# EAGLE design CoffeeMakersch (EAGLE 7.2.0)
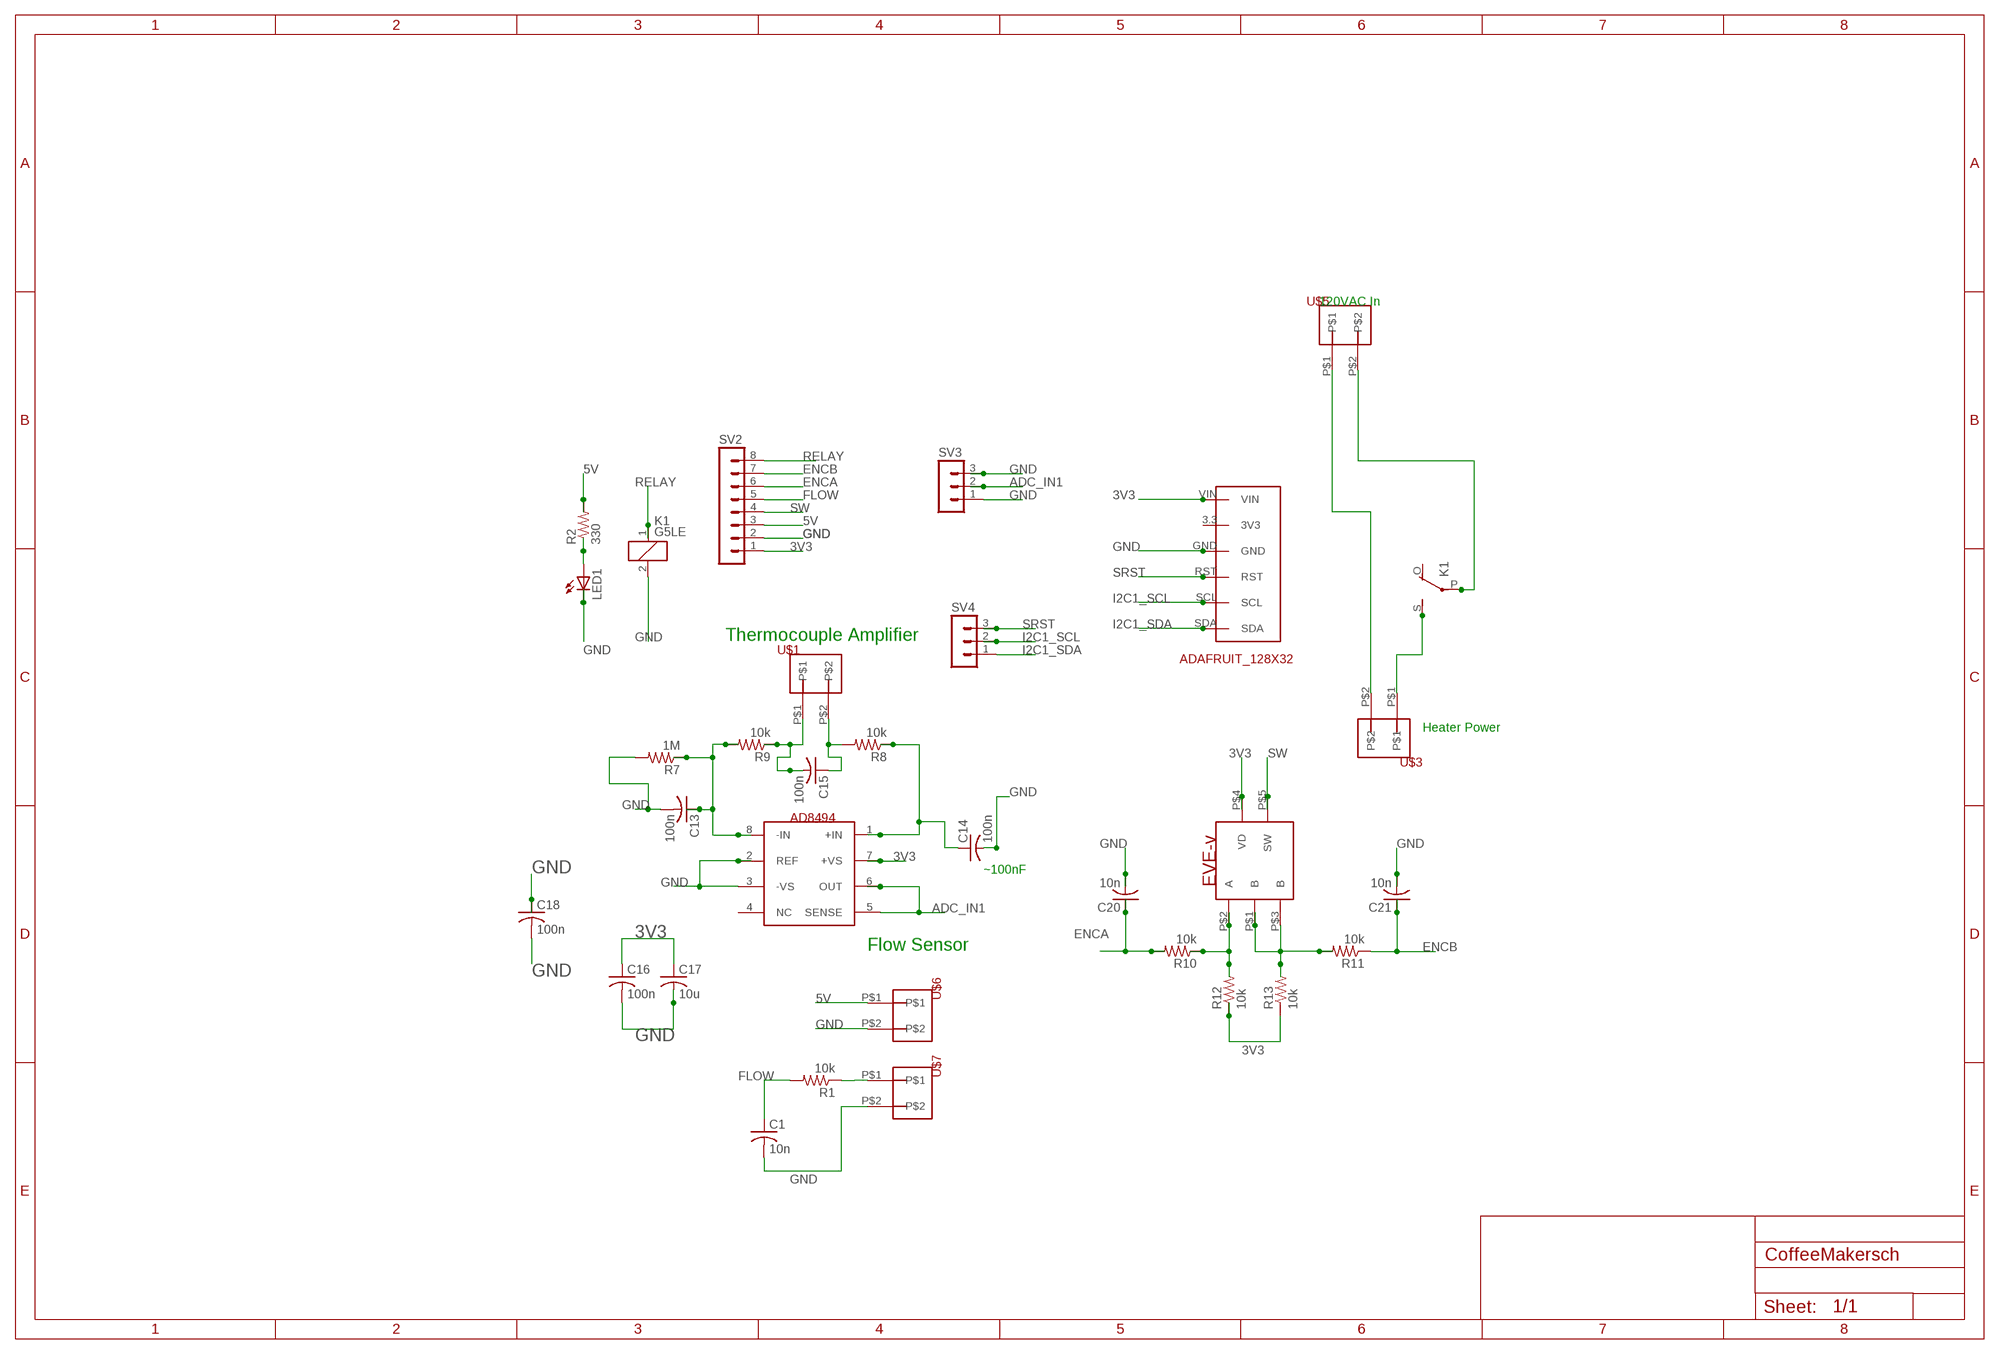
[diagram p0: schematic, sheet 1]

## Parts
C1  10n  C-USC0805  [C0805]
C13  100n  C-USC0805  [C0805]
C14  100n  C-USC0805  [C0805]
C15  100n  C-USC0805  [C0805]
C16  100n  C-USC0805  [C0805]
C17  10u  C-USC0805  [C0805]
C18  100n  C-USC0805  [C0805]
C20  10n  C-USC0805  [C0805]
C21  10n  C-USC0805  [C0805]
K1  G5LE  [G5LE]
LED1  LEDCHIPLED_1206  [CHIPLED_1206]
R1  10k  R-US_R0805  [R0805]
R2  330  R-US_R0805  [R0805]
R7  1M  R-US_R0805  [R0805]
R8  10k  R-US_R0805  [R0805]
R9  10k  R-US_R0805  [R0805]
R10  10k  R-US_R0805  [R0805]
R11  10k  R-US_R0805  [R0805]
R12  10k  R-US_R0805  [R0805]
R13  10k  R-US_R0805  [R0805]
SV2  MA08-1  [MA08-1]
SV3  MA03-1  [MA03-1]
SV4  MA03-1  [MA03-1]
U$1  5TERM  [5TERM]
U$2  AD8494  [TSSOP8]
U$3  5TERM  [5TERM]
U$4  EVE-V  [EVE-V]
U$5  5TERM  [5TERM]
U$6  5TERM  [5TERM]
U$7  5TERM  [5TERM]
U$11  ADAFRUIT_128X32  [ADAFRUIT128X32]

## Nets
3V3: C16.1 C17.1 R12.1 R13.1 SV2.1 U$2.7(+VS) U$4.P$4(VD) U$11.VIN
5V: R2.2 SV2.3 U$6.P$1
ADC_IN1: SV3.2 U$2.5(SENSE) U$2.6(OUT)
ENCA: C20.1 R10.2 SV2.6
ENCB: C21.1 R11.1 SV2.7
FLOW: C1.1 R1.2 SV2.5
GND: C1.2 C13.2 C14.2 C16.2 C17.2 C18.1 C18.2 C20.2 C21.2 K1.2 LED1.C R7.2 SV2.2 SV3.1 SV3.3 U$2.2(REF) U$2.3(-VS) U$6.P$2 U$7.P$2 U$11.GND
I2C1_SCL: SV4.2 U$11.SCL
I2C1_SDA: SV4.1 U$11.SDA
N$1: R1.1 U$7.P$1
N$2: K1.P(2:P) U$5.P$2
N$3: U$3.P$2 U$5.P$1
N$4: K1.S(2:S) U$3.P$1
N$5: LED1.A R2.1
N$6: C13.1 R7.1 R9.2 U$2.8(-IN)
N$7: C14.1 R8.1 U$2.1(+IN)
N$8: C15.1 R8.2 U$1.P$2
N$9: C15.2 R9.1 U$1.P$1
N$13: R10.1 R12.2 U$4.P$2(A)
N$14: R11.2 R13.2 U$4.P$1(B) U$4.P$3(B)
RELAY: K1.1 SV2.8
SRST: SV4.3 U$11.RST
SW: SV2.4 U$4.P$5(SW)
Unconnected: K1.O(2:O) U$2.4(NC) U$11.3.3(3V3)

## Notes on the sheet
- 120VAC In
- Thermocouple Amplifier
- Heater Power
- ~100nF
- Flow Sensor

## Library data of the parts
C1 C13-C18 C20 C21 = rcl:C-US: CAPACITOR, American symbol
K1 = relay:G5LE: RELAY 1 x switch, 10 A/120 V AC, 8 A/30 V DC, Omron; OC_FARNELL: unknown; OC_NEWARK: unknown
LED1 = led:LED: LED OSRAM: - CHIPLED LG R971, LG N971, LY N971, LG Q971, LY Q971, LO R971, LY R971 LH N974, LH R974 LS Q976, LO Q976, LY Q976 LO Q996 - Hyper CHIPLED LW Q18S LB Q993, LB Q99A, LB R99A - SideLED LS A670, LO A670, LY A670, LG A670, LP A670 LB A673, LV A673, LT A673, LW A673 LH A674 LY A675 LS A676, LA A676, LO A676, LY A676, LW A676 LS A679, LY A679, LG A679 - Hyper Micro SIDELED® LS Y876, LA Y876, LO Y876, LY Y876 LT Y87S - SmartLED LW L88C, LW L88S LB L89C, LB L89S, LG L890 LS L89K, LO L89K, LY L89K LS L896, LA L896, LO L896, LY L896 - TOPLED LS T670, LO T670, LY T670, LG T670, LP T670 LSG T670, LSP T670, LSY T670, LOP T670, LYG T670 LG T671, LOG T671, LSG T671 LB T673, LV T673, LT T673, LW T673 LH T674 LS T676, LA T676, LO T676, LY T676, LB T676, LH T676, LSB T676, LW T676 LB T67C, LV T67C, LT T67C, LS T67K, LO T67K, LY T67K, LW E67C LS E67B, LA E67B, LO E67B, LY E67B, LB E67C, LV E67C, LT E67C LW T67C LS T679, LY T679, LG T679 LS T770, LO T770, LY T770, LG T770, LP T770 LB T773, LV T773, LT T773, LW T773 LH T774 LS E675, LA E675, LY E675, LS T675 LS T776, LA T776, LO T776, LY T776, LB T776 LHGB T686 LT T68C, LB T68C - Hyper Mini TOPLED® LB M676 - Mini TOPLED Santana® LG M470 LS M47K, LO M47K, LY M47K Source: http://www.osram.convergy.de LUXEON: - LUMILED® LXK2-PW12-R00, LXK2-PW12-S00, LXK2-PW14-U00, LXK2-PW14-V00 LXK2-PM12-R00, LXK2-PM12-S00, LXK2-PM14-U00 LXK2-PE12-Q00, LXK2-PE12-R00, LXK2-PE12-S00, LXK2-PE14-T00, LXK2-PE14-U00 LXK2-PB12-K00, LXK2-PB12-L00, LXK2-PB12-M00, LXK2-PB14-N00, LXK2-PB14-P00, LXK2-PB14-Q00 LXK2-PR12-L00, LXK2-PR12-M00, LXK2-PR14-Q00, LXK2-PR14-R00 LXK2-PD12-Q00, LXK2-PD12-R00, LXK2-PD12-S00 LXK2-PH12-R00, LXK2-PH12-S00 LXK2-PL12-P00, LXK2-PL12-Q00, LXK2-PL12-R00 Source: www.luxeon.com KINGBRIGHT: KA-3528ASYC Source: www.kingbright.com
R1 R2 R7-R13 = rcl:R-US_: RESISTOR, American symbol
SV2 = con-lstb:MA08-1: PIN HEADER; OC_FARNELL: unknown; OC_NEWARK: unknown
SV3 SV4 = con-lstb:MA03-1: PIN HEADER; OC_FARNELL: unknown; OC_NEWARK: unknown
U$1 U$3 U$5-U$7 = EmbSystems:5TERM
U$2 = EmbSystems:AD8494
U$4 = EmbSystems:EVE-V
U$11 = EmbSystems:ADAFRUIT_128X32

## Board
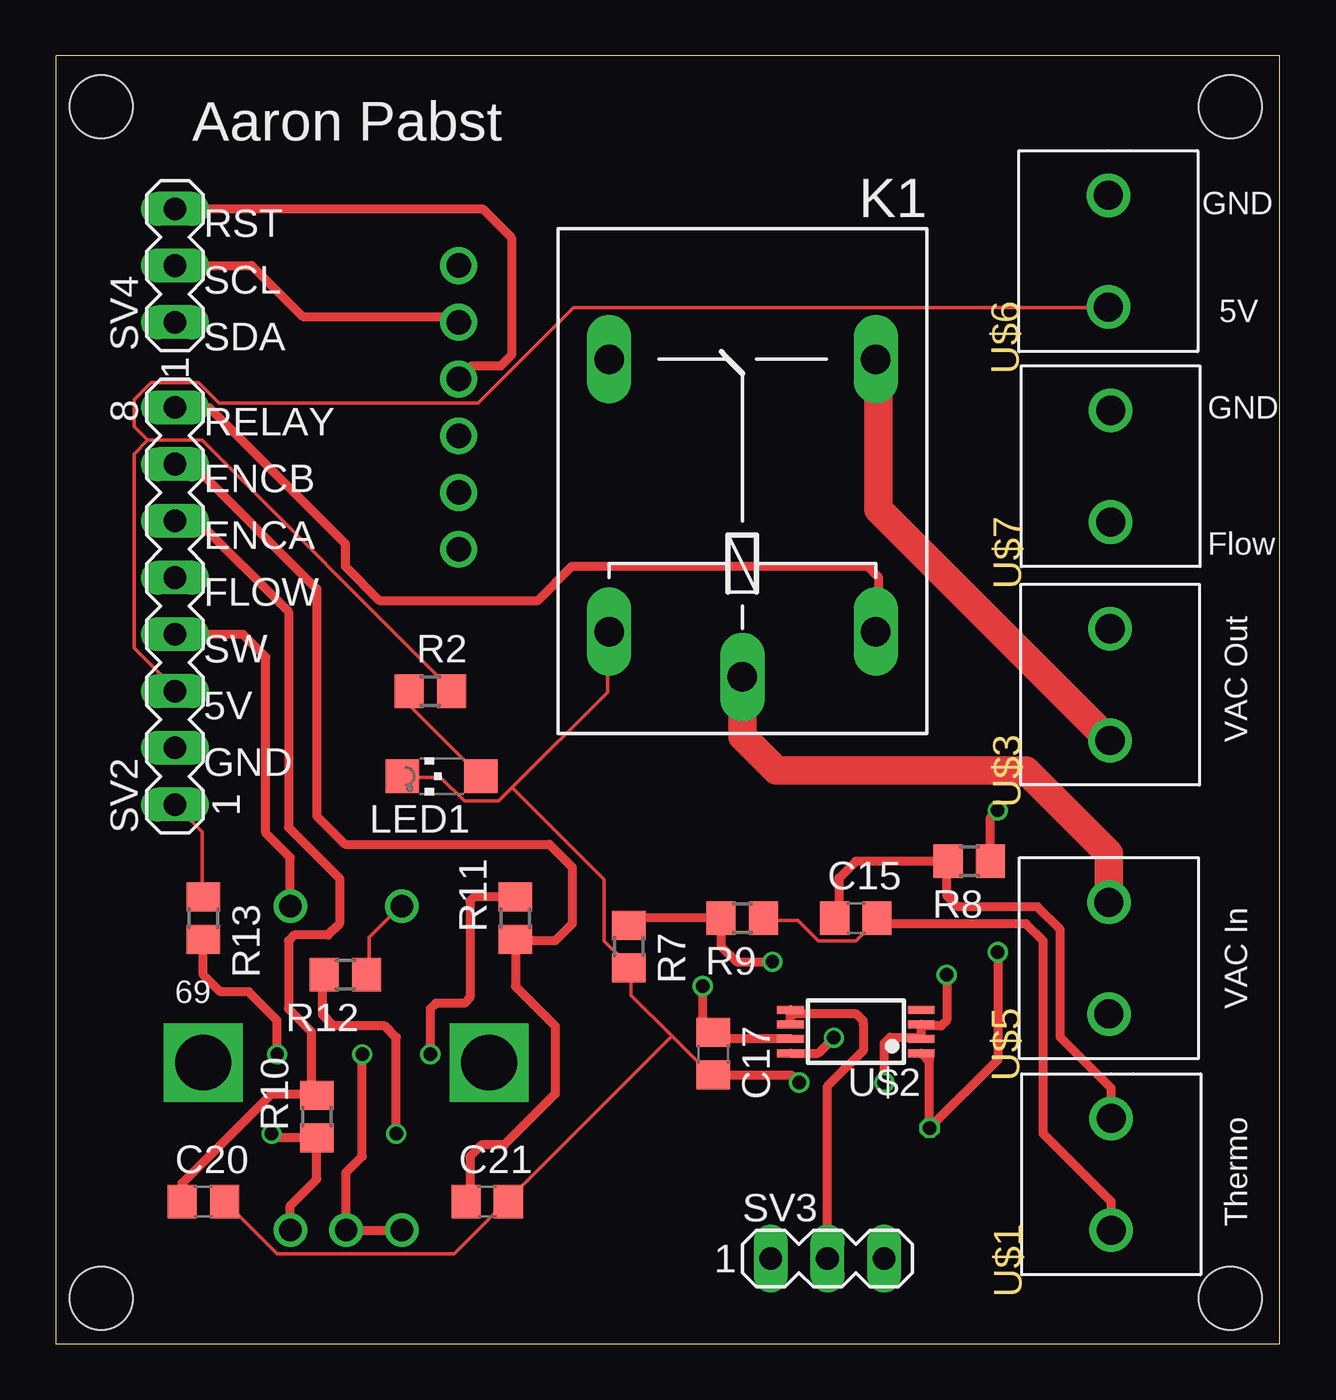
[diagram p1: board, top side]
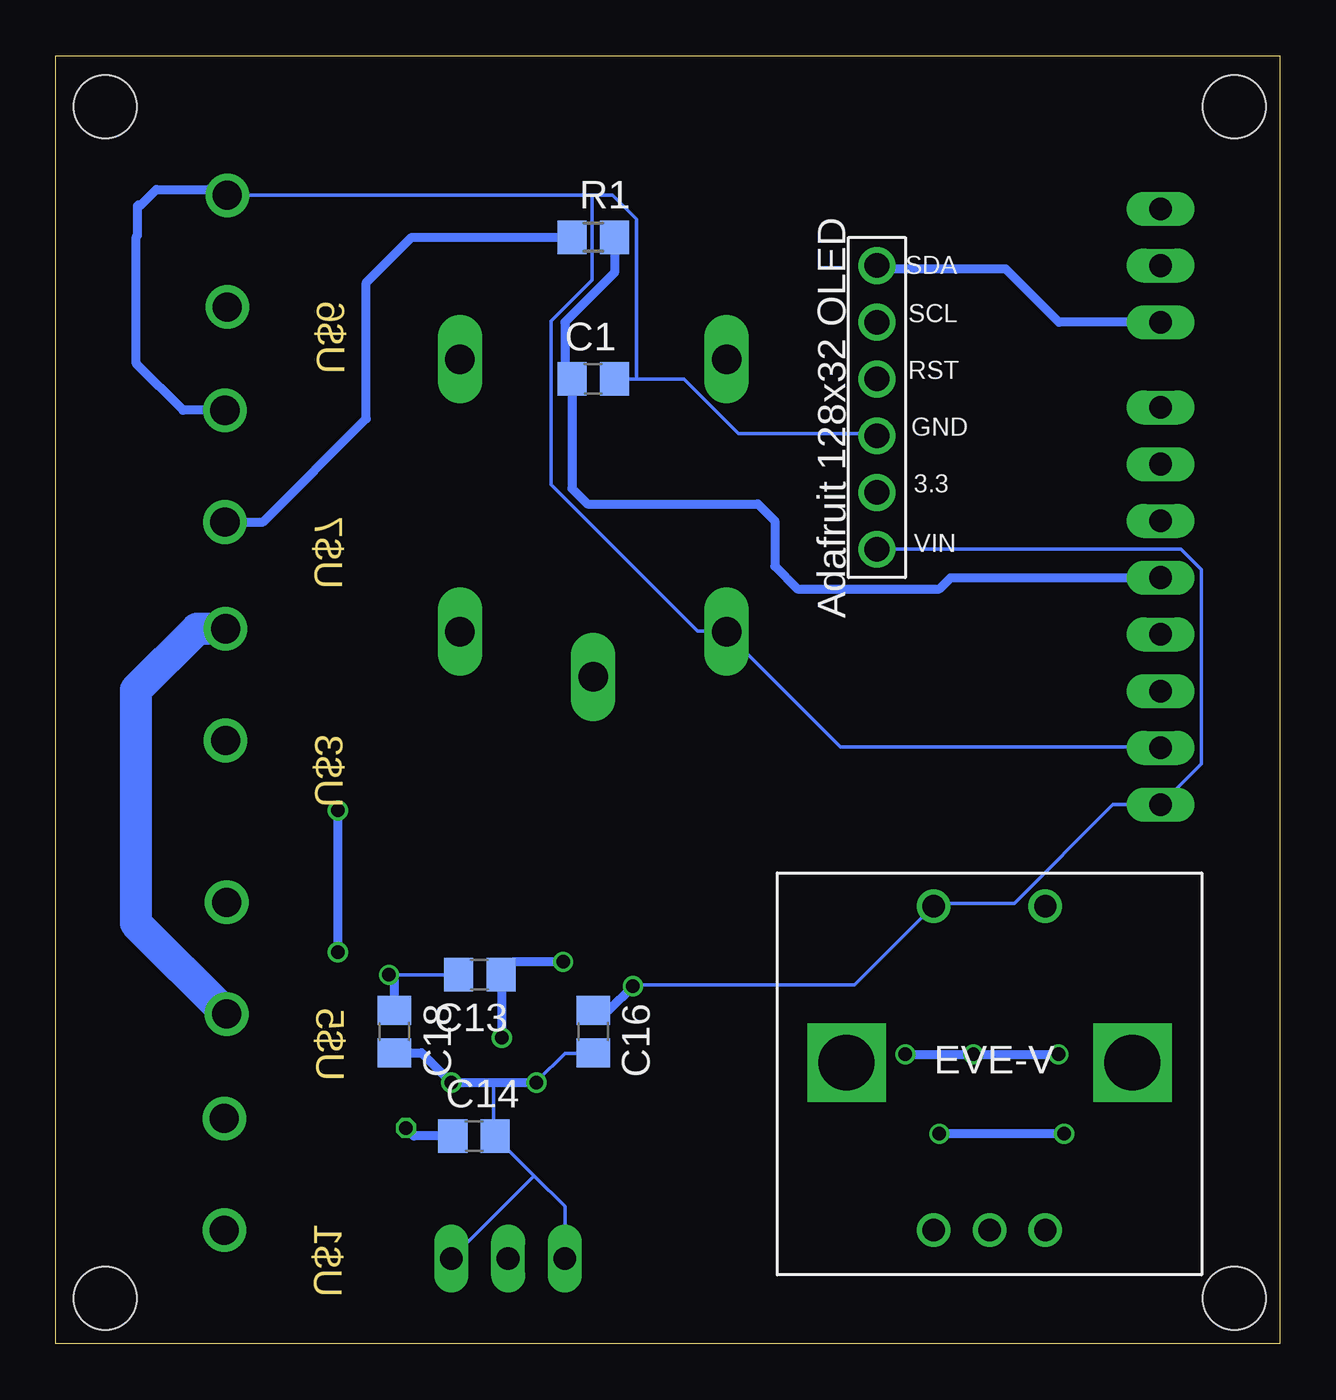
[diagram p2: board, bottom side, seen from below]

Size 54.79 x 57.65 mm. Coordinates in mm from the lower left corner, seen from the top.
Outline: 0,0 54.79,0 54.79,57.65 0,57.65 0,0
Copper layers (1*16): Top 0.035559375mm / dielectric 1.6mm / Bottom 0.035559375mm
Design rules "oshpark-2layer": minimum track width 6mil, minimum drill 10mil, track to track 6mil, track to pad 6mil, pad to pad 6mil, via to via 6mil, smd to smd 6mil, copper to edge 15mil, drill to drill 6mil, minimum pad ring 5mil, minimum via ring 5mil, stop-mask expansion 2.5mil, vias tented up to drill 0mil, thermal gap 10mil
Holes 2.8 mm at 2.03,2.03 52.58,2.03 52.58,55.37 2.03,55.37

### Footprints (pad centres in the part's own frame; a part is rotated, then mirrored left to right if it is on the bottom)
C0805 = smd 1.3 x 1.5: 1 -0.95,0; 2 0.95,0
G5LE = drill 1.321 long: 1 -7.493,-5.969; 2 -7.493,5.969; O 4.699,5.969; P -9.525,0; S 4.699,-5.969
CHIPLED_1206 = smd 1.5 x 1.5: A 0,-1.75; C 0,1.75
R0805 = smd 1.3 x 1.5: 1 -0.95,0; 2 0.95,0
MA08-1 = drill 1.016 long: 1 -8.89,0; 2 -6.35,0; 3 -3.81,0; 4 -1.27,0; 5 1.27,0; 6 3.81,0; 7 6.35,0; 8 8.89,0
MA03-1 = drill 1.016 long: 1 -2.54,0; 2 0,0; 3 2.54,0
5TERM = drill 1.3: P$1 0,0; P$2 5,0
TSSOP8 = smd 1.2 x 0.35: 1 -2.925,0.975; 2 -2.925,0.325; 3 -2.925,-0.325; 4 -2.925,-0.975; 5 2.925,-0.975; 6 2.925,-0.325; 7 2.925,0.325; 8 2.925,0.975
EVE-V = drill 1: P$1 0,0; P$2 5,0; P$3 2.5,0; P$4 0,14.5; P$5 5,14.5 | drill 2.5 square: P$6 -3.9,7.5; P$7 8.9,7.5
ADAFRUIT128X32 = drill 1.1: 3.3 10.16,0; GND 7.62,0; RST 5.08,0; SCL 2.54,0; SDA 0,0; VIN 12.7,0

### Placement (x,y rotation side)
C1  30.73,43.18 0 bottom
C13  35.81,16.51 180 bottom
C14  36.07,9.3 0 bottom
C15  35.81,19.05 0 top
C16  30.73,13.97 270 bottom
C17  29.44,12.98 270 top
C18  39.62,13.97 270 bottom
C20  6.6,6.35 0 top
C21  19.3,6.35 0 top
K1  30.73,39.37 90 top
LED1  17.27,25.4 90 top
R1  30.73,49.53 0 bottom
R2  16.76,29.21 0 top
R7  25.65,17.78 270 top
R8  40.89,21.59 180 top
R9  30.73,19.05 180 top
R10  11.68,10.16 90 top
R11  20.57,19.05 90 top
R12  12.95,16.51 180 top
R13  6.6,19.05 270 top
SV2  5.33,33.02 90 top
SV3  34.54,3.81 0 top
SV4  5.33,48.26 90 top
U$1  47.24,5.08 90 top
U$2  35.81,13.97 180 top
U$3  47.19,27 90 top
U$4  15.49,5.08 0 bottom
U$5  47.14,14.76 90 top
U$6  47.12,46.41 90 top
U$7  47.22,36.78 90 top
U$11  18.03,48.26 270 bottom

### Tracks (layer width: path | path; a pad name or v marks a point on that pad's centre or on a via)
3V3  (via drill 0.6)
  Top 0.152: R12.1 14.02,16.51 14.02,18.19 15.39,19.56 U$4.P$4 | SV2.1 6.55,22.91 6.55,20.02 R13.1
  Top 0.406: U$2.7 29.72,13.64 C17.1 28.96,14.41 v28.96,16
  Bottom 0.152: v28.96,16 28.8,16.05 19.05,16.05 15.55,19.56 U$4.P$4 15.39,19.71 11.89,19.71 7.47,24.13 SV2.1 3.5,25.96 3.5,34.65 4.42,35.56 U$11.VIN
  Bottom 0.406: C16.1 30.04,14.92 v28.96,16
5V
  Top 0.152: 4.12,40.44 6.55,40.44 17.68,29.31 R2.2 | 4.12,40.44 3.5,39.83 3.5,31.14 5.33,29.31 SV2.3 | 4.12,40.44 3.5,41.05 3.5,42.27 4.27,43.03 6.4,43.03 7.32,42.11 18.9,42.11 23.16,46.38 47.09,46.38 U$6.P$1
ADC_IN1
  Top 0.406: U$2.6 U$2.5 33.08,14.76 35.84,14.76 36.14,14.45 36.14,14.3 36.17,14.28 36.17,13.16 34.54,11.53 SV3.2
ENCA
  Top 0.406: C20.1 5.65,7.18 9.65,11.18 11.62,11.18 R10.2 11.43,11.36 11.43,13.97 10.41,14.99 10.41,18.03 10.67,18.29 12.19,18.29 12.7,18.8 12.7,20.83 10.41,23.11 10.41,32.77 6.35,36.83 SV2.6
ENCB
  Top 0.406: C21.1 18.54,6.54 18.54,8.38 19.05,8.89 20.07,8.89 22.35,11.18 22.35,14.22 20.57,16 R11.1 20.64,18.03 22.35,18.03 23.11,18.8 23.11,21.34 22.1,22.35 12.95,22.35 11.68,23.62 11.68,33.78 6.1,39.37 SV2.7
FLOW
  Bottom 0.406: R1.2 29.78,47.94 32,45.72 32,43.5 C1.1 31.68,38.29 30.99,37.59 23.37,37.59 22.61,36.83 22.61,34.8 21.59,33.78 15.24,33.78 14.73,34.29 SV2.5
GND  (via drill 0.6)
  Top 0.152: 20.42,24.89 24.69,29.16 24.69,31.75 K1.2 | 20.42,24.89 19.81,24.28 18.29,24.28 17.22,25.35 15.55,25.35 LED1.C | C20.2 7.62,6.3 9.91,4.01 17.83,4.01 20.12,6.3 C21.2 20.27,6.45 27.58,13.77 | 27.58,13.77 29.26,12.09 C17.2 | 27.58,13.77 25.76,15.6 25.76,16.82 R7.2 25.6,16.97 24.54,18.03 24.54,20.78 20.42,24.89
  Top 0.406: C17.2 32.93,12.03 v33.27,11.68 | v37.08,11.68 37.08,13.46 37.34,13.72 38.67,13.72 U$2.2 U$2.3 38.81,14.22 39.62,14.22 39.88,14.48 v39.88,16.51
  Bottom 0.152: 28.8,43.18 26.67,43.18 24.23,40.74 18.14,40.74 U$11.GND | 28.8,43.18 C1.2 | 28.8,43.18 28.8,50.34 29.87,51.41 30.79,51.41 | 30.79,51.41 46.94,51.41 U$6.P$2 | SV2.2 5.33,26.72 19.66,26.72 24.69,31.75 K1.2 24.84,31.9 26.06,31.9 32.61,38.46 32.61,45.77 30.79,47.6 30.79,51.41 | C16.2 30.79,13 32,13 33.22,11.79 v33.27,11.68 | 35.2,11.68 35.2,9.35 C14.2 35.05,9.2 33.38,7.52 | v39.88,16.51 C13.2 | SV3.1 32,6.15 33.38,7.52 | 33.38,7.52 SV3.3
  Bottom 0.406: U$7.P$2 49.09,41.78 51.18,43.87 51.18,49.55 51.13,49.61 51.13,50.93 51.08,50.98 50.98,50.98 50.29,51.66 47.95,51.66 47.85,51.56 47.27,51.56 U$6.P$2 | v33.27,11.68 35.2,11.68 v37.08,11.68 38.42,13.02 C18.2 | C18.1 39.62,16.26 v39.88,16.51
I2C1_SCL
  Top 0.406: SV4.2 8.76,48.26 11.05,45.97 17.78,45.97 U$11.SCL
I2C1_SDA
  Bottom 0.406: SV4.1 9.88,45.72 12.27,48.11 17.88,48.11 U$11.SDA
N$1
  Bottom 0.406: U$7.P$1 45.52,36.78 40.89,41.4 40.89,47.5 38.86,49.53 R1.1
N$2
  Top 1.27: U$5.P$2 47.14,21.95 43.43,25.65 32.26,25.65 30.73,27.18 K1.P
N$3
  Bottom 1.422: U$3.P$2 48.47,32 51.21,29.26 51.21,18.82 U$5.P$1
N$4
  Top 1.27: U$3.P$1 47.17,27 36.83,37.34 36.83,43.94 K1.S
N$5
  Top 0.152: R2.1 15.85,29.16 15.85,28.55 18.9,25.5 LED1.A
N$6  (via drill 0.6)
  Top 0.406: R7.1 25.97,19.05 R9.2 29.78,17.79 30.48,17.09 v32.08,17.09 | U$2.8 34.13,12.99 v34.82,13.69
  Bottom 0.406: v32.08,17.09 34.28,17.09 C13.1 34.82,16.47 v34.82,13.69
N$7  (via drill 0.6)
  Top 0.406: U$2.1 38.99,12.74 39.12,12.74 v39.12,9.65 42.16,12.7 v42.16,17.53 | R8.1 41.84,23.56 v42.16,23.88
  Bottom 0.406: C14.1 38.76,9.3 v39.12,9.65 | v42.16,23.88 v42.16,17.53
N$8
  Top 0.406: C15.1 35.05,19.24 35.05,20.83 35.81,21.59 R8.2 39.88,21.52 39.88,20.07 40.39,19.56 43.94,19.56 44.96,18.54 44.96,13.72 47.24,11.43 U$1.P$2
N$9
  Top 0.152: R9.1 31.7,18.95 33.22,18.95 34.14,18.03 35.81,18.03 36.73,18.95 C15.2
  Top 0.406: U$1.P$1 47.24,6.35 44.2,9.4 44.2,18.03 43.43,18.8 37.02,18.8 C15.2
N$13  (via drill 0.6)
  Top 0.406: U$4.P$2 10.49,6.18 11.68,7.37 R10.1 9.84,9.21 v9.65,9.4 | v15.24,9.4 15.24,13.72 14.73,14.22 12.45,14.22 11.94,14.73 11.94,16.44 R12.2
  Bottom 0.406: v9.65,9.4 v15.24,9.4
N$14  (via drill 0.6)
  Top 0.406: U$4.P$1 U$4.P$3 12.99,7.66 13.72,8.38 v13.72,12.95 | v9.91,12.95 9.91,14.48 8.64,15.75 7.37,15.75 6.6,16.51 R13.2 | R11.2 18.73,20 18.54,19.81 18.54,15.49 18.29,15.24 17.02,15.24 16.76,14.99 v16.76,12.95
  Bottom 0.406: v9.91,12.95 v13.72,12.95 v16.76,12.95
RELAY
  Top 0.406: SV2.8 6.86,41.91 12.95,35.81 12.95,34.8 14.48,33.27 21.59,33.27 23.11,34.8 36.32,34.8 36.83,34.29 36.83,32 K1.1
SRST
  Top 0.406: SV4.3 19.1,50.8 20.4,49.51 20.4,44.25 19.91,43.76 18.62,43.76 U$11.RST
SW
  Top 0.406: U$4.P$5 10.49,21.76 9.4,22.86 9.4,30.73 8.38,31.75 SV2.4

### Text on the board
tNames: Aaron Pabst | GND | RST | SCL | 5V | SDA | GND | RELAY | ENCB | ENCA | Flow | FLOW | SW | 5V | VAC Out | GND | 69 | VAC In | Thermo